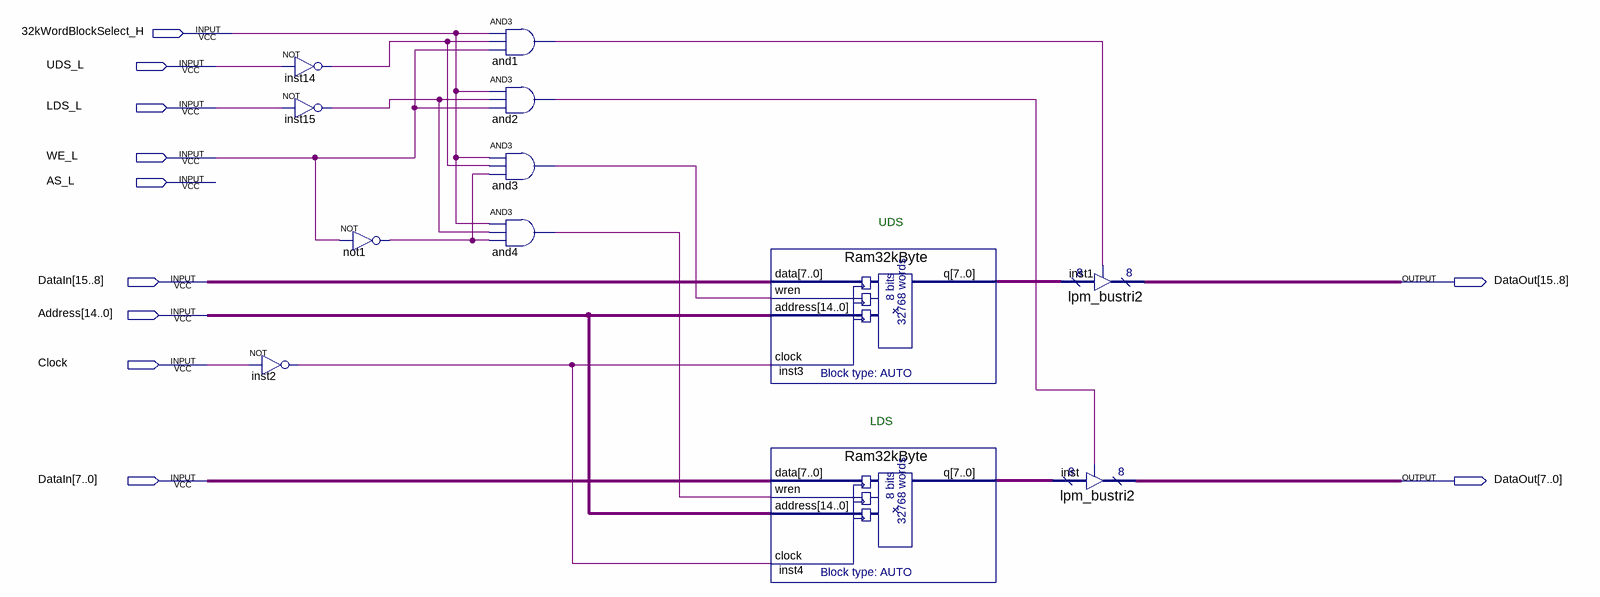
[diagram p0: schematic sheet]
// Quartus schematic SramBlock_32KWord.bdf as structural Verilog: 12 symbols, 11 pins
module SramBlock_32KWord (
  input  \32kWordBlockSelect_H ,
  input  UDS_L,
  input  LDS_L,
  input  WE_L,
  input  AS_L,
  input  [15:0] DataIn,
  input  [14:0] Address,
  input  Clock,
  output [15:0] DataOut
);

  wire and1_out, and2_out, and3_out, and4_out, inst2_out, inst14_out, inst15_out, not1_out;
  wire [7:0] inst3_q, inst4_q;

  not inst2 (inst2_out, Clock);
  not inst14 (inst14_out, UDS_L);
  not inst15 (inst15_out, LDS_L);
  not not1 (not1_out, WE_L);
  and and1 (and1_out, \32kWordBlockSelect_H , inst14_out, WE_L);
  and and2 (and2_out, \32kWordBlockSelect_H , inst15_out, WE_L);
  and and3 (and3_out, \32kWordBlockSelect_H , inst14_out, not1_out);
  and and4 (and4_out, \32kWordBlockSelect_H , inst15_out, not1_out);
  Ram32kByte inst3 (.data(DataIn[15:8]), .wren(and3_out), .address(Address), .clock(inst2_out), .q(inst3_q));
  Ram32kByte inst4 (.data(DataIn[7:0]), .wren(and4_out), .address(Address), .clock(inst2_out), .q(inst4_q));
  lpm_bustri2 inst1 (.enabledt(and1_out), .data(inst3_q), .tridata(DataOut[15:8]));
  lpm_bustri2 inst (.enabledt(and2_out), .data(inst4_q), .tridata(DataOut[7:0]));

  // Notes on the sheet:
  //   UDS
  //   LDS
endmodule
